# Altium schematic sheet 04_STM32F373VBTx.SchDoc
size 420 x 297 mm; SheetNumber: 4; SheetTotal: 12
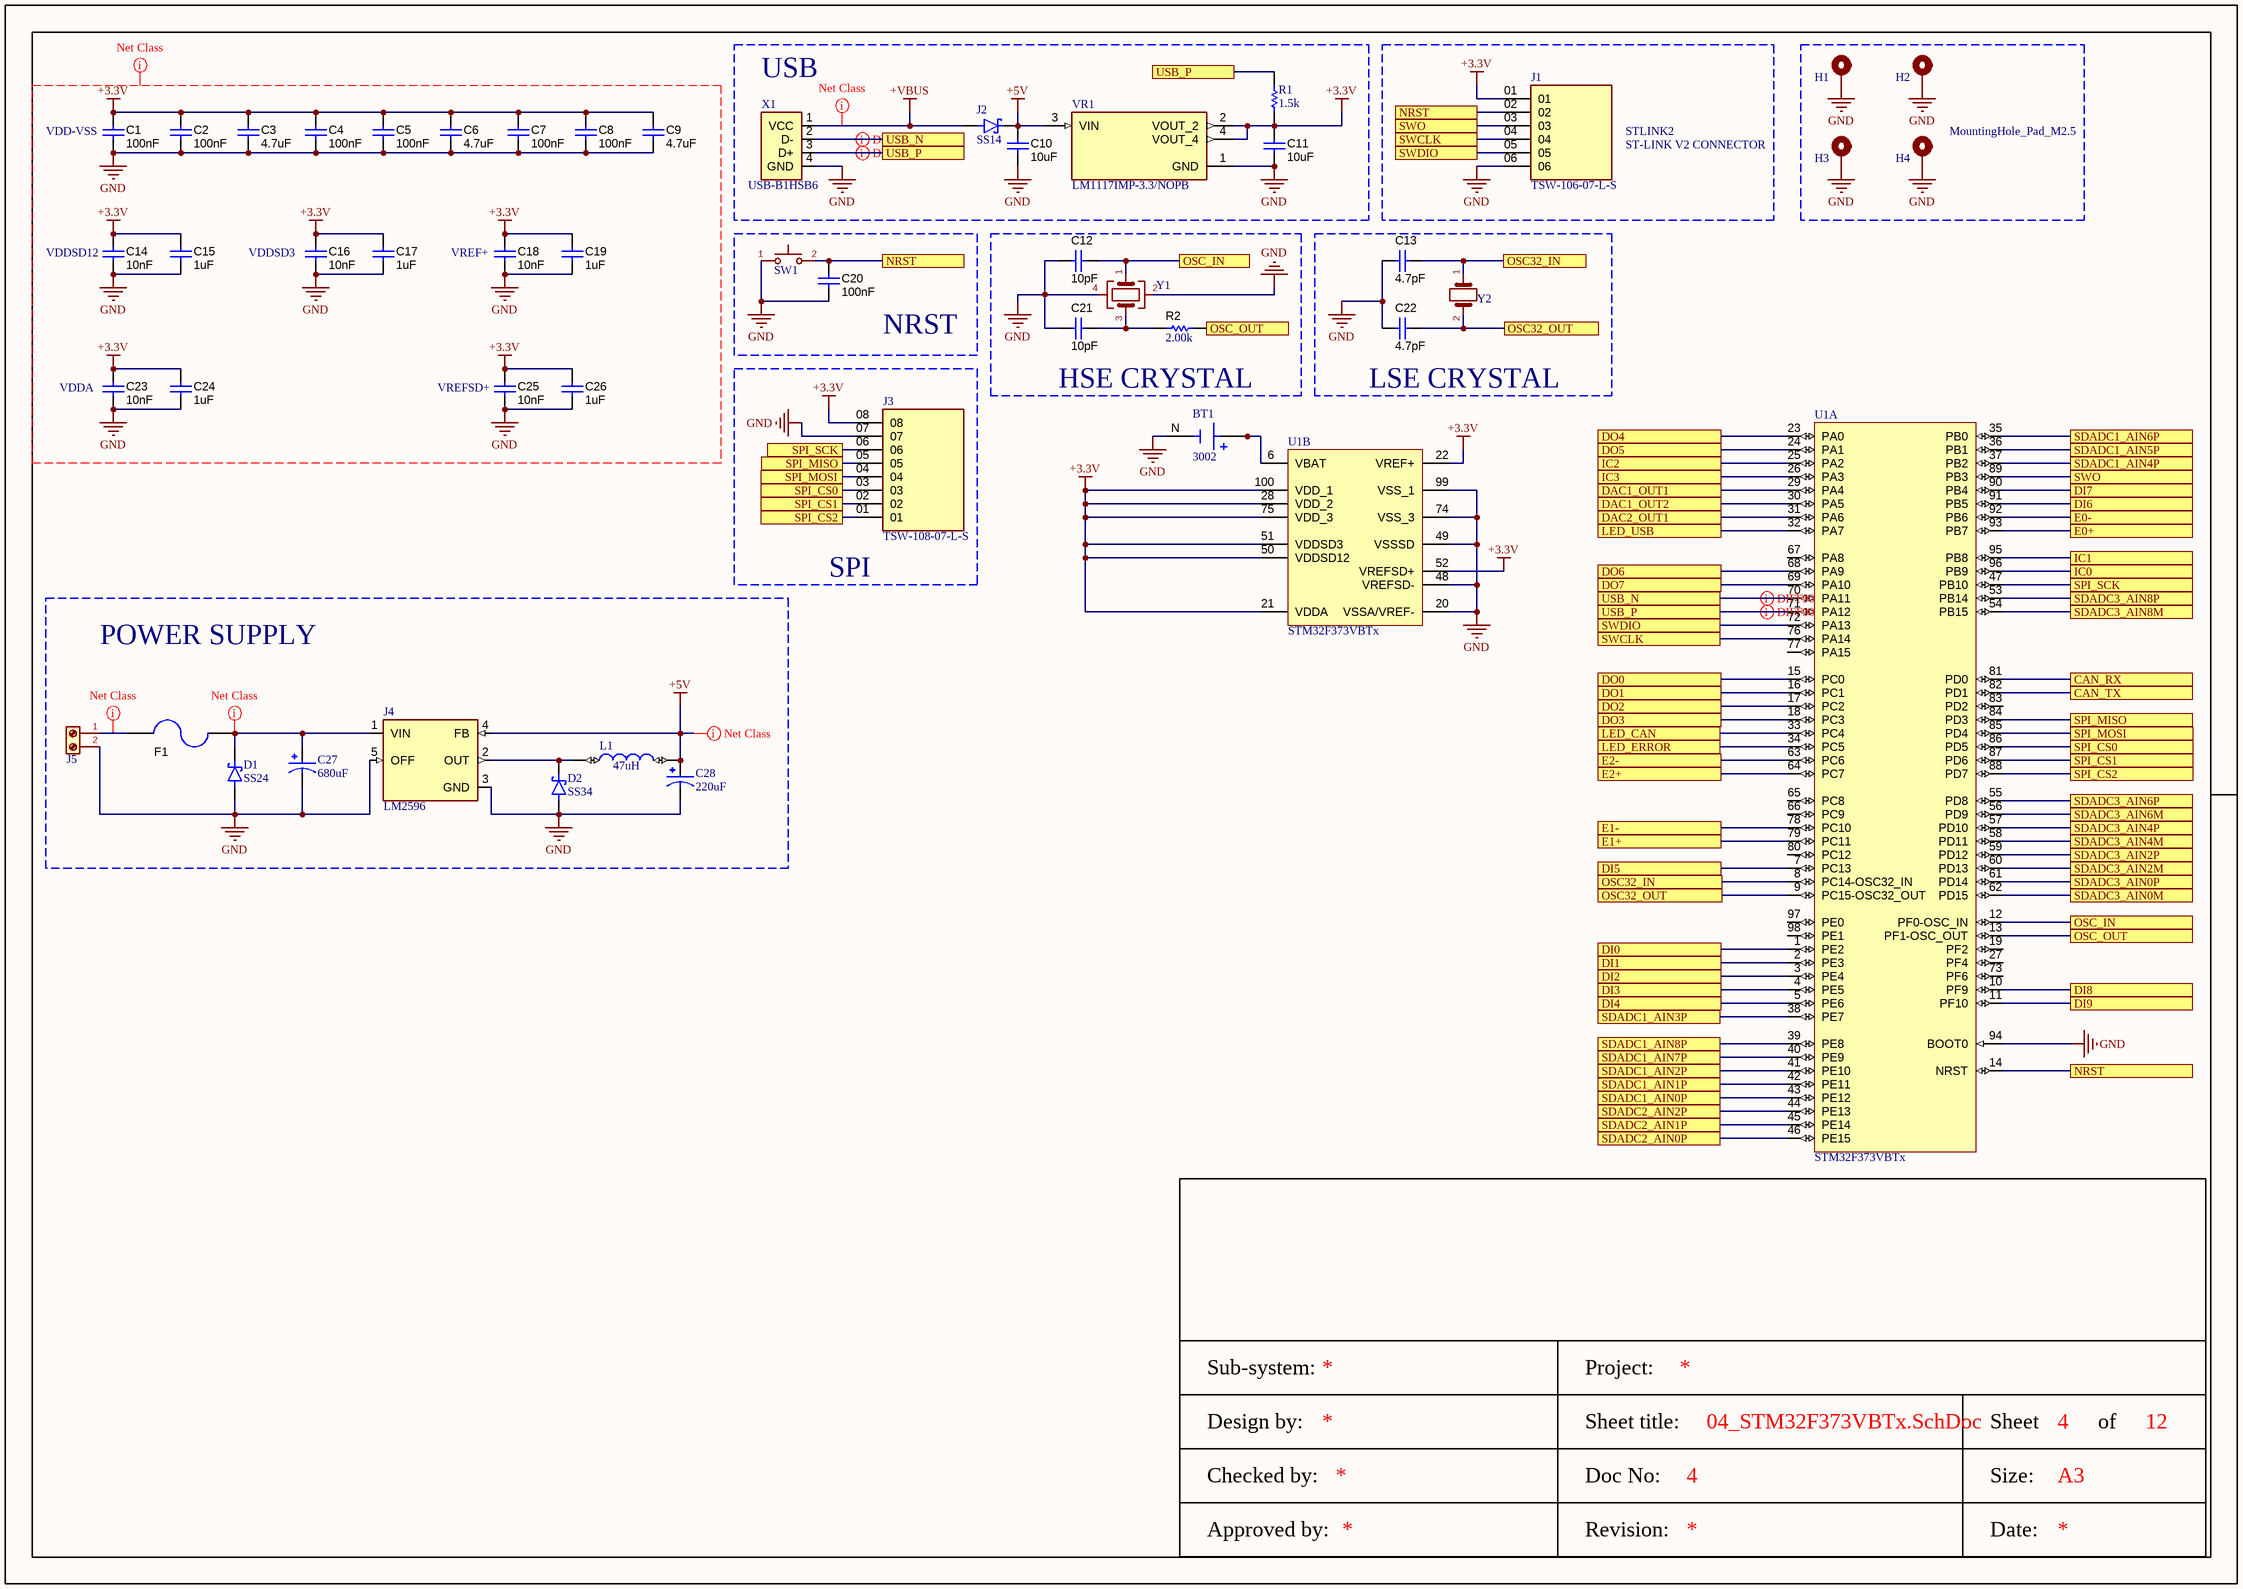
[diagram p0: 04_STM32F373VBTx.SchDoc]

## Parts
BT1  3002  [BAT_3002]
C1  ValueDisplayed: 100nF  [0603]  (hidden comment: CAP 100nF 0603)
C2  ValueDisplayed: 100nF  [0603]  (hidden comment: CAP 100nF 0603)
C3  ValueDisplayed: 4.7uF  [0603]  (hidden comment: CAP 4.7uF 0603)
C4  ValueDisplayed: 100nF  [0603]  (hidden comment: CAP 100nF 0603)
C5  ValueDisplayed: 100nF  [0603]  (hidden comment: CAP 100nF 0603)
C6  ValueDisplayed: 4.7uF  [0603]  (hidden comment: CAP 4.7uF 0603)
C7  ValueDisplayed: 100nF  [0603]  (hidden comment: CAP 100nF 0603)
C8  ValueDisplayed: 100nF  [0603]  (hidden comment: CAP 100nF 0603)
C9  ValueDisplayed: 4.7uF  [0603]  (hidden comment: CAP 4.7uF 0603)
C10  ValueDisplayed: 10uF  [0603]  (hidden comment: GCM188R71C105KA64D)
C11  ValueDisplayed: 10uF  [0603]  (hidden comment: GCM188R71C105KA64D)
C12  ValueDisplayed: 10pF  [0402L]  (hidden comment: CGA2B3X7R1H104K050BB)
C13  ValueDisplayed: 4.7pF  [0402L]  (hidden comment: GJM1555C1H4R7BB01D)
C14  ValueDisplayed: 10nF  [0603]  (hidden comment: CAP 10nF 0603)
C15  ValueDisplayed: 1uF  [0603]  (hidden comment: GCM188R71C105KA64D)
C16  ValueDisplayed: 10nF  [0603]  (hidden comment: CAP 10nF 0603)
C17  ValueDisplayed: 1uF  [0603]  (hidden comment: GCM188R71C105KA64D)
C18  ValueDisplayed: 10nF  [0603]  (hidden comment: CAP 10nF 0603)
C19  ValueDisplayed: 1uF  [0603]  (hidden comment: GCM188R71C105KA64D)
C20  ValueDisplayed: 100nF  [0603]  (hidden comment: CAP 100nF 0603)
C21  ValueDisplayed: 10pF  [0402L]  (hidden comment: CGA2B3X7R1H104K050BB)
C22  ValueDisplayed: 4.7pF  [0402L]  (hidden comment: GJM1555C1H4R7BB01D)
C23  ValueDisplayed: 10nF  [0603]  (hidden comment: CAP 10nF 0603)
C24  ValueDisplayed: 1uF  [0603]  (hidden comment: GCM188R71C105KA64D)
C25  ValueDisplayed: 10nF  [0603]  (hidden comment: CAP 10nF 0603)
C26  ValueDisplayed: 1uF  [0603]  (hidden comment: GCM188R71C105KA64D)
C27  680uF  [CAP_EEETK1V331AQ]
C28  220uF  [CAP_EEEFT1E471AV]
D1  SS24  [DIOM5336X265N]
D2  SS34  [DIOM5336X265N]
F1  0440005.WR  [CAPC4520X203N]  (value not drawn)
H1  MountingHole_Pad M2.5  [MountingHole_2.7mm_M2.5_DIN965_Pad]  (value not drawn)
H2  MountingHole_Pad M2.5  [MountingHole_2.7mm_M2.5_DIN965_Pad]  (value not drawn)
H3  MountingHole_Pad M2.5  [MountingHole_2.7mm_M2.5_DIN965_Pad]  (value not drawn)
H4  MountingHole_Pad M2.5  [MountingHole_2.7mm_M2.5_DIN965_Pad]  (value not drawn)
J1  TSW-106-07-L-S  [SAMTEC_TSW-106-07-L-S]
J2  SS14  [SMA]
J3  TSW-108-07-L-S  [SAMTEC_TSW-108-07-L-S]
J4  LM2596  [TO263-5]
J5  Terminal_01x02_P5.00  [TerminalBlock_Phoenix_PT-1,5-2-5.0-H_1x02_P5.00mm_Horizontal]  (value not drawn)
L1  47uH  [INDPM120120X800N]
R1  ValueDisplayed: 1.5k  [0603]  (hidden comment: RES 1.5K 0603)
R2  ValueDisplayed: 2.00k  [0402L]  (hidden comment: CRCW04021K00FKED)
SW1  SW_Push 3X6x2.5MM  [SW_SPST_FSMSM]  (value not drawn)
U1  STM32F373VBTx  [STM-LQFP100_N]  (parts A,B of 2)
VR1  LM1117IMP-3.3/NOPB  [VREG_LM1117IMP-3.3/NOPB]
X1  USB-B1HSB6  [OST_USB-B1HSB6]
Y1  Crystal 8MHz 3225  [Crystal_SMD_3225-4Pin_3.2x2.5mm_HandSoldering]  (value not drawn)
Y2  Crystal 32.768KHz 3215  [Crystal_SMD_EuroQuartz_EQ161-2Pin_3.2x1.5mm_HandSoldering]  (value not drawn)

## Blocks framed on the sheet
USB: C10 C11 J2 R1 VR1 X1
MountingHole_Pad_M2.5: H1-H4
NRST: C20 SW1
HSE CRYSTAL: C12 C21 R2 Y1
LSE CRYSTAL: C13 C22 Y2
SPI: J3
POWER SUPPLY: C27 C28 D1 D2 F1 J4 J5 L1

## Ports
CAN_RX (see 09_CAN[1A]), CAN_TX (see 09_CAN[1A]), DAC1_OUT1 (see 11_DAC[1A]), DAC1_OUT2 (see 11_DAC[1B]), DAC2_OUT1 (see 11_DAC[2A]), DI0 (see 05_INPUT[2A]), DI1 (see 05_INPUT[2B]), DI2 (see 05_INPUT[2B]), DI3 (see 05_INPUT[2C]), DI4 (see 05_INPUT[2C]), DI5 (see 05_INPUT[3A]), DI6 (see 05_INPUT[3B]), DI7 (see 05_INPUT[3B]), DI8 (see 05_INPUT[3C]), DI9 (see 05_INPUT[3C]), DO0 (see 06_DIGITAL[1A]), DO1 (see 06_DIGITAL[1B]), DO2 (see 06_DIGITAL[1B]), DO3 (see 06_DIGITAL[1C]), DO4 (see 06_DIGITAL[2A]), DO5 (see 06_DIGITAL[2B]), DO6 (see 06_DIGITAL[2B]), DO7 (see 06_DIGITAL[2C]), E0+ (see 08_INPUTCAPTURE_ENCODER[5B]), E0- (see 08_INPUTCAPTURE_ENCODER[5B]), E1+ (see 08_INPUTCAPTURE_ENCODER[5B]), E1- (see 08_INPUTCAPTURE_ENCODER[5B]), E2+ (see 08_INPUTCAPTURE_ENCODER[5B]), E2- (see 08_INPUTCAPTURE_ENCODER[5B]), IC0 (see 08_INPUTCAPTURE_ENCODER[3B]), IC1 (see 08_INPUTCAPTURE_ENCODER[3B]), IC2 (see 08_INPUTCAPTURE_ENCODER[3B]), IC3 (see 08_INPUTCAPTURE_ENCODER[3B]), LED_CAN (see 12_LED[2B]), LED_ERROR (see 12_LED[2B]), LED_USB (see 12_LED[2A]), NRST (see 04_STM32F373VBTx[3A], 04_STM32F373VBTx[4A]), NRST (see 04_STM32F373VBTx[3A], 04_STM32F373VBTx[6C]), NRST (see 04_STM32F373VBTx[4A], 04_STM32F373VBTx[6C]), OSC32_IN (see 04_STM32F373VBTx[5A]), OSC32_IN (see 04_STM32F373VBTx[5C]), OSC32_OUT (see 04_STM32F373VBTx[5A]), OSC32_OUT (see 04_STM32F373VBTx[5C]), OSC_IN (see 04_STM32F373VBTx[4A]), OSC_IN (see 04_STM32F373VBTx[6C]), OSC_OUT (see 04_STM32F373VBTx[4A]), OSC_OUT (see 04_STM32F373VBTx[6C]), SDADC1_AIN0P (see 10_SDADC[3B]), SDADC1_AIN1P (see 10_SDADC[3A]), SDADC1_AIN2P (see 10_SDADC[3A]), SDADC1_AIN3P (see 10_SDADC[2B]), SDADC1_AIN4P (see 10_SDADC[2B]), SDADC1_AIN5P (see 10_SDADC[2A]), SDADC1_AIN6P (see 10_SDADC[2A]), SDADC1_AIN7P (see 10_SDADC[2C]), SDADC1_AIN8P (see 10_SDADC[2B]), SDADC2_AIN0P (see 10_SDADC[3C]), SDADC2_AIN1P (see 10_SDADC[3B]), SDADC2_AIN2P (see 10_SDADC[3B]), SDADC3_AIN0M (see 07_SDDADC[3B]), SDADC3_AIN0P (see 07_SDDADC[3B]), SDADC3_AIN2M (see 07_SDDADC[3A]), SDADC3_AIN2P (see 07_SDDADC[3A]), SDADC3_AIN4M (see 07_SDDADC[2C]), SDADC3_AIN4P (see 07_SDDADC[2B]), SDADC3_AIN6M (see 07_SDDADC[2B]), SDADC3_AIN6P (see 07_SDDADC[2B]), SDADC3_AIN8M (see 07_SDDADC[2A]), SDADC3_AIN8P (see 07_SDDADC[2A]), SPI_CS0 (see 04_STM32F373VBTx[3B]), SPI_CS0 (see 04_STM32F373VBTx[6B]), SPI_CS1 (see 04_STM32F373VBTx[3B]), SPI_CS1 (see 04_STM32F373VBTx[6B]), SPI_CS2 (see 04_STM32F373VBTx[3B]), SPI_CS2 (see 04_STM32F373VBTx[6B]), SPI_MISO (see 04_STM32F373VBTx[3B]), SPI_MISO (see 04_STM32F373VBTx[6B]), SPI_MOSI (see 04_STM32F373VBTx[3B]), SPI_MOSI (see 04_STM32F373VBTx[6B]), SPI_SCK (see 04_STM32F373VBTx[3B]), SPI_SCK (see 04_STM32F373VBTx[6B]), SWCLK (see 04_STM32F373VBTx[4A]), SWCLK (see 04_STM32F373VBTx[5B]), SWDIO (see 04_STM32F373VBTx[4A]), SWDIO (see 04_STM32F373VBTx[5B]), SWO (see 04_STM32F373VBTx[4A]), SWO (see 04_STM32F373VBTx[6B]), USB_N (see 04_STM32F373VBTx[3A]), USB_N (see 04_STM32F373VBTx[5B]), USB_P (see 04_STM32F373VBTx[3A], 04_STM32F373VBTx[4A]), USB_P (see 04_STM32F373VBTx[3A], 04_STM32F373VBTx[5B]), USB_P (see 04_STM32F373VBTx[4A], 04_STM32F373VBTx[5B])

## Nets
+3.3V: C1.1 C2.1 C3.1 C4.1 C5.1 C6.1 C7.1 C8.1 C9.1 C11.1 C14.1 C15.1 C16.1 C17.1 C18.1 C19.1 C23.1 C24.1 C25.1 C26.1 J1.01 J3.08 R1.1 U1.21(VDDA) U1.22(VREF+) U1.28(VDD_2) U1.50(VDDSD12) U1.51(VDDSD3) U1.52(VREFSD+) U1.75(VDD_3) U1.100(VDD_1) VR1.2(VOUT_2) VR1.4(VOUT_4)
+5V: C10.1 C28.1 J2.P2(C) J4.4(FB) L1.2 VR1.3(VIN)
+VBUS: J2.P1(A) X1.1(VCC)
GND: BT1.N(NEG) C1.2 C2.2 C3.2 C4.2 C5.2 C6.2 C7.2 C8.2 C9.2 C10.2 C11.2 C12.2 C13.2 C14.2 C15.2 C16.2 C17.2 C18.2 C19.2 C20.2 C21.2 C22.2 C23.2 C24.2 C25.2 C26.2 C27.2 C28.2 D1.A D2.A H1.1 H2.1 H3.1 H4.1 J1.06 J3.07 J4.3(GND) J4.5(OFF) J5.2(Pin_2) SW1.1 U1.20(VSSA/VREF-) U1.48(VREFSD-) U1.49(VSSSD) U1.74(VSS_3) U1.94(BOOT0) U1.99(VSS_1) VR1.1(GND) X1.4(GND) Y1.2 Y1.4
CAN_RX: U1.81(PD0) ; port CAN_RX
CAN_TX: U1.82(PD1) ; port CAN_TX
DAC1_OUT1: U1.29(PA4) ; port DAC1_OUT1
DAC1_OUT2: U1.30(PA5) ; port DAC1_OUT2
DAC2_OUT1: U1.31(PA6) ; port DAC2_OUT1
DI0: U1.1(PE2) ; port DI0
DI1: U1.2(PE3) ; port DI1
DI2: U1.3(PE4) ; port DI2
DI3: U1.4(PE5) ; port DI3
DI4: U1.5(PE6) ; port DI4
DI5: U1.7(PC13) ; port DI5
DI6: U1.91(PB5) ; port DI6
DI7: U1.90(PB4) ; port DI7
DI8: U1.10(PF9) ; port DI8
DI9: U1.11(PF10) ; port DI9
DO0: U1.15(PC0) ; port DO0
DO1: U1.16(PC1) ; port DO1
DO2: U1.17(PC2) ; port DO2
DO3: U1.18(PC3) ; port DO3
DO4: U1.23(PA0) ; port DO4
DO5: U1.24(PA1) ; port DO5
DO6: U1.68(PA9) ; port DO6
DO7: U1.69(PA10) ; port DO7
E0+: U1.93(PB7) ; port E0+
E0-: U1.92(PB6) ; port E0-
E1+: U1.79(PC11) ; port E1+
E1-: U1.78(PC10) ; port E1-
E2+: U1.64(PC7) ; port E2+
E2-: U1.63(PC6) ; port E2-
IC0: U1.96(PB9) ; port IC0
IC1: U1.95(PB8) ; port IC1
IC2: U1.25(PA2) ; port IC2
IC3: U1.26(PA3) ; port IC3
LED_CAN: U1.33(PC4) ; port LED_CAN
LED_ERROR: U1.34(PC5) ; port LED_ERROR
LED_USB: U1.32(PA7) ; port LED_USB
NRST: C20.1 J1.02 SW1.2 U1.14(NRST) ; port NRST
OSC32_IN: C13.1 U1.8(PC14-OSC32_IN) Y2.1 ; port OSC32_IN
OSC32_OUT: C22.1 U1.9(PC15-OSC32_OUT) Y2.2 ; port OSC32_OUT
OSC_IN: C12.1 U1.12(PF0-OSC_IN) Y1.1 ; port OSC_IN
OSC_OUT: R2.2 U1.13(PF1-OSC_OUT) ; port OSC_OUT
SDADC1_AIN0P: U1.43(PE12) ; port SDADC1_AIN0P
SDADC1_AIN1P: U1.42(PE11) ; port SDADC1_AIN1P
SDADC1_AIN2P: U1.41(PE10) ; port SDADC1_AIN2P
SDADC1_AIN3P: U1.38(PE7) ; port SDADC1_AIN3P
SDADC1_AIN4P: U1.37(PB2) ; port SDADC1_AIN4P
SDADC1_AIN5P: U1.36(PB1) ; port SDADC1_AIN5P
SDADC1_AIN6P: U1.35(PB0) ; port SDADC1_AIN6P
SDADC1_AIN7P: U1.40(PE9) ; port SDADC1_AIN7P
SDADC1_AIN8P: U1.39(PE8) ; port SDADC1_AIN8P
SDADC2_AIN0P: U1.46(PE15) ; port SDADC2_AIN0P
SDADC2_AIN1P: U1.45(PE14) ; port SDADC2_AIN1P
SDADC2_AIN2P: U1.44(PE13) ; port SDADC2_AIN2P
SDADC3_AIN0M: U1.62(PD15) ; port SDADC3_AIN0M
SDADC3_AIN0P: U1.61(PD14) ; port SDADC3_AIN0P
SDADC3_AIN2M: U1.60(PD13) ; port SDADC3_AIN2M
SDADC3_AIN2P: U1.59(PD12) ; port SDADC3_AIN2P
SDADC3_AIN4M: U1.58(PD11) ; port SDADC3_AIN4M
SDADC3_AIN4P: U1.57(PD10) ; port SDADC3_AIN4P
SDADC3_AIN6M: U1.56(PD9) ; port SDADC3_AIN6M
SDADC3_AIN6P: U1.55(PD8) ; port SDADC3_AIN6P
SDADC3_AIN8M: U1.54(PB15) ; port SDADC3_AIN8M
SDADC3_AIN8P: U1.53(PB14) ; port SDADC3_AIN8P
SPI_CS0: J3.03 U1.86(PD5) ; port SPI_CS0
SPI_CS1: J3.02 U1.87(PD6) ; port SPI_CS1
SPI_CS2: J3.01 U1.88(PD7) ; port SPI_CS2
SPI_MISO: J3.05 U1.84(PD3) ; port SPI_MISO
SPI_MOSI: J3.04 U1.85(PD4) ; port SPI_MOSI
SPI_SCK: J3.06 U1.47(PB10) ; port SPI_SCK
SWCLK: J1.04 U1.76(PA14) ; port SWCLK
SWDIO: J1.05 U1.72(PA13) ; port SWDIO
SWO: J1.03 U1.89(PB3) ; port SWO
USB_N: U1.70(PA11) X1.2(D-) ; port USB_N
USB_P: R1.2 U1.71(PA12) X1.3(D+) ; port USB_P
NetBT1_P1: BT1.P1(POS) BT1.P2(POS) U1.6(VBAT)
NetC21_1: C21.1 R2.1 Y1.3
NetC27_1: C27.1 D1.C(K) F1.1 J4.1(VIN)
NetD2_C: D2.C(K) J4.2(OUT) L1.1
NetF1_2: F1.2 J5.1(Pin_1)

Not connected (* = marked no-connect by the designer): U1 19(PF2) 27(PF4) 65(PC8) 66(PC9) 67(PA8) 73(PF6) 77(PA15) 80(PC12) 83(PD2) 97(PE0) 98(PE1)

## Layout directives
net class PWR: +3.3V, +5V, +VBUS, GND, NetC27_1, NetF1_2
differential pair; differential pair class DIFF90: USB_N, USB_P

## Notes on the sheet
- (near C1) VDD-VSS
- STLINK2
- ST-LINK V2 CONNECTOR
- (near C14) VDDSD12
- (near C16) VDDSD3
- (near C18) VREF+
- (near C23) VDDA
- (near C25) VREFSD+
- Sub-system:
- Project:
- Design by:
- Sheet title:
- Sheet
- of
- Checked by:
- Approved by:
- Doc No:
- Revision:
- Size:
- Date:
- A3

## Library data of the parts
BT1 = 3002: Battery Holder: SMT, 1 Coin Cell, 20mm, PhosBronze/Tin-Nickel | Keystone Electronics 3002; MF: Keystone Electronics Corp.; SnapEDA_Link: https://www.snapeda.com/parts/3002/Keystone/view-part/?ref=snap; Package: NON STANDARD-2 Keystone; Value: *; MP: 3002; Check_prices: https://www.snapeda.com/parts/3002/Keystone/view-part/?ref=eda
C1 C2 C4 C5 C7 C8 C20 = CAP 100nF 0603: CAP, CERM, 100 nF, 25 V, +/- 10%, X7R, AEC-Q200 Grade 1, 0603; Manufacturer: MuRata; PartNumber: GCM188R70J225KE22D; TaMin_C: -55°C; Polarized: N; SizeAreaWB_mm2: 4.68; Value1: Unknown; U/M: EA; Value: 2.2uF; TaMax_C: 125°C; SizeZ_mm: 1; SizeX_mm: 1.6; SizeY_mm: 0.8; Value2: 6.3V; SizeArea_mm2: 1.28; CompType: Capacitor; AEC Qualified: Y; Cap_F: 2.2µF; AEC Category: Q200; Supplier Part Number 2: 81-GCM188R70J225KE2D; Publisher: Texas Instruments; Supplier 2: Mouser; TempCo: X7R; Published: 2008-06-19; RoHS: Y; MountType: SMT; Supplier 1: Digi-Key; PackageReference: 0603; Tolerance_%: 10%; Cap_Case: 0603; LatestRevisionDate: 2017-03-09; VDC_V: 6.3V; ComponentLink1Description: Datasheet link; AEC Grade: 1; Supplier Part Number 1: 490-5316-1-ND; Technology: Ceramic; ComponentLink1URL: http://psearch.en.murata.com/capacitor/product/GCM188R70J225KE22%23.pdf
C3 C6 C9 = CAP 4.7uF 0603: CAP, CERM, 4.7 uF, 10 V, +/- 10%, X7R, AEC-Q200 Grade 1, 0603; Manufacturer: MuRata; PartNumber: GCM188R70J225KE22D; TaMin_C: -55°C; Polarized: N; SizeAreaWB_mm2: 4.68; Value1: Unknown; U/M: EA; Value: 2.2uF; TaMax_C: 125°C; SizeZ_mm: 1; SizeX_mm: 1.6; SizeY_mm: 0.8; Value2: 6.3V; SizeArea_mm2: 1.28; CompType: Capacitor; AEC Qualified: Y; Cap_F: 2.2µF; AEC Category: Q200; Supplier Part Number 2: 81-GCM188R70J225KE2D; Publisher: Texas Instruments; Supplier 2: Mouser; TempCo: X7R; Published: 2008-06-19; RoHS: Y; MountType: SMT; Supplier 1: Digi-Key; PackageReference: 0603; Tolerance_%: 10%; Cap_Case: 0603; LatestRevisionDate: 2017-03-09; VDC_V: 6.3V; ComponentLink1Description: Datasheet link; AEC Grade: 1; Supplier Part Number 1: 490-5316-1-ND; Technology: Ceramic; ComponentLink1URL: http://psearch.en.murata.com/capacitor/product/GCM188R70J225KE22%23.pdf
C10 C11 C15 C17 C19 C24 C26 = CAP 1uF 0603: CAP, CERM, 1 uF, 16 V, +/- 10%, X7R, AEC-Q200 Grade 1, 0603; Manufacturer: MuRata; TaMin_C: -55°C; Polarized: N; SizeAreaWB_mm2: 4.68; Value1: Unknown; U/M: EA; Value: 1uF; TaMax_C: 125°C; SizeZ_mm: 1; SizeX_mm: 1.6; SizeY_mm: 0.8; Value2: 16V; SizeArea_mm2: 1.28; CompType: Capacitor; AEC Qualified: Y; Cap_F: 1µF; AEC Category: Q200; Supplier Part Number 2: 81-GCM188R71C105K64D; Publisher: Texas Instruments; Supplier 2: Mouser; TempCo: X7R; Published: 2008-06-19; RoHS: Y; MountType: SMT; Supplier 1: Digi-Key; PackageReference: 0603; Tolerance_%: 10%; Cap_Case: 0603; LatestRevisionDate: 2017-03-09; PartNumber: GCM188R71C105KA64D; VDC_V: 16V; ComponentLink1Description: Datasheet link; AEC Grade: 1; Supplier Part Number 1: 490-5241-6-ND; Technology: Ceramic; ComponentLink1URL: http://psearch.en.murata.com/capacitor/product/GCM188R71C105KA64%23.pdf
C12 C21 = CAP 10pF 0402 50V: CAP, CERM, 10 pF, 50 V, +/- 5%, X7R, AEC-Q200 Grade 1, 0402; Manufacturer: TDK; TaMin_C: -55°C; ESR_ohm: 0.039064; Polarized: N; SizeAreaWB_mm2: 3; Value1: 0.039064 ohm; U/M: EA; Value: 0.1uF; TaMax_C: 125°C; Tolerance_%: 10%; SizeZ_mm: 0.6; SizeX_mm: 1; SizeY_mm: 0.5; Cap_Case: 0402; Value2: 50V; CompType: Capacitor; AEC Qualified: Y; Cap_F: 100nF; IRMS_A: 8.14669dA; AEC Category: Q200; Supplier Part Number 2: 04X3148; Publisher: Texas Instruments; Supplier 2: Newark; Supplier Part Number 3: 810-CGA2B3X7R1H104K; TempCo: X7R; Supplier 3: Mouser; Published: 2008-06-19; RoHS: Y; MountType: SMT; Supplier 1: Digi-Key; PackageReference: 0402; SizeArea_mm2: 0.5; LatestRevisionDate: 2017-03-09; PartNumber: CGA2B3X7R1H104K050BB; VDC_V: 50V; ComponentLink1Description: Datasheet link; AEC Grade: 1; Supplier Part Number 1: 445-6899-1-ND; Technology: Ceramic; ComponentLink1URL: https://product.tdk.com/en/search/capacitor/ceramic/mlcc/info?part_no=CGA2B3X7R1H104K050BB
C13 C22 = CAP 4.7pF 0402: CAP, CERM, 4.7 pF, 50 V, +/- 2%, C0G/NP0, 0402; Manufacturer: MuRata; TaMin_C: -55°C; Polarized: N; SizeAreaWB_mm2: 3; Value1: Unknown; U/M: EA; Value: 4.7pF; TaMax_C: 125°C; SizeZ_mm: 0.6; SizeX_mm: 1; SizeY_mm: 0.5; Cap_Case: 0402; Value2: 50V; CompType: Capacitor; AEC Category: Q200; Supplier Part Number 2: 81-GJM1555C1H4R7BB01; Publisher: Texas Instruments; Supplier 2: Mouser; TempCo: C0G/NP0; Published: 2008-06-19; RoHS: Y; MountType: SMT; Supplier 1: Digi-Key; PackageReference: 0402; Tolerance_%: 2%; SizeArea_mm2: 0.5; LatestRevisionDate: 2017-03-09; PartNumber: GJM1555C1H4R7BB01D; AEC Qualified: N; Cap_F: 4.7pF; VDC_V: 50V; ComponentLink1Description: Datasheet link; AEC Grade: N/A; Supplier Part Number 1: 490-8102-1-ND; Technology: Ceramic; ComponentLink1URL: http://psearch.murata.com/capacitor/product/GJM1555C1H4R7BB01%23.pdf
C14 C16 C18 C23 C25 = CAP 10nF 0603: CAP, CERM, 10 nF, 50 V, +/- 10%, X7R, AEC-Q200 Grade 1, 0603; Manufacturer: MuRata; PartNumber: GCM188R70J225KE22D; TaMin_C: -55°C; Polarized: N; SizeAreaWB_mm2: 4.68; Value1: Unknown; U/M: EA; Value: 2.2uF; TaMax_C: 125°C; SizeZ_mm: 1; SizeX_mm: 1.6; SizeY_mm: 0.8; Value2: 6.3V; SizeArea_mm2: 1.28; CompType: Capacitor; AEC Qualified: Y; Cap_F: 2.2µF; AEC Category: Q200; Supplier Part Number 2: 81-GCM188R70J225KE2D; Publisher: Texas Instruments; Supplier 2: Mouser; TempCo: X7R; Published: 2008-06-19; RoHS: Y; MountType: SMT; Supplier 1: Digi-Key; PackageReference: 0603; Tolerance_%: 10%; Cap_Case: 0603; LatestRevisionDate: 2017-03-09; VDC_V: 6.3V; ComponentLink1Description: Datasheet link; AEC Grade: 1; Supplier Part Number 1: 490-5316-1-ND; Technology: Ceramic; ComponentLink1URL: http://psearch.en.murata.com/capacitor/product/GCM188R70J225KE22%23.pdf
C27 = CAP ALUMINUM: CAPACITOR ALUM ELEC, 330UF, 20%, 35V, SMD; Product Range:PANASONIC - TK Series; Capacitance:330ÂµF; Capacitance Tolerance:Â± 20%; Capacitor Case Style:SMD; Diameter:12.5mm; ESR:0.12ohm; Height:13.5mm; Operating Temperature Max:125Â°C ;RoHS Compliant: Yes; MP: EEETK1V331AQ; Value: *; Price: None; Package: RADIAL-2 Panasonic; MF: Panasonic; Availability: No availability data; Check_prices: https://www.snapeda.com/parts/EEETK1V331AQ/Panasonic/view-part/5787067/?ref=eda; SnapEDA_Link: https://www.snapeda.com/parts/EEETK1V331AQ/Panasonic/view-part/5787067/?ref=snap
C28 = CAP ALUMINUM 8X10.5MM: Aluminum Electrolytic Capacitors, FT-V (????????) Series, 470uF +/- 20%, 25V, Surface mount type(8x10.5mm) Vibration-proof product; MF: Panasonic; MP: EEE-FT1E471AV; SnapEDA_Link: https://www.snapeda.com/parts/EEE-FT1E471AV/Panasonic/view-part/?ref=snap; Package: RADIAL-2 Panasonic; Value: *; Check_prices: https://www.snapeda.com/parts/EEE-FT1E471AV/Panasonic/view-part/?ref=eda
D1 D2 = SS24: Diode Schottky 40V 2A Surface Mount DO-214AA (SMB); MF: ON Semiconductor; Package: DO-214AA ON Semiconductor; Price: None; Value: *; SnapEDA_Link: https://www.snapeda.com/parts/SS24/Onsemi/view-part/?ref=snap; MP: SS24; Availability: In Stock; Check_prices: https://www.snapeda.com/parts/SS24/Onsemi/view-part/?ref=eda
F1 = FUSE 1808: Fuse, 5 A, 32VAC/VDC, SMD; Manufacturer: Littelfuse; Irating_A: 5A; SizeAreaWB_mm2: 10.92; Interrupt_AC: 50A; VAC_V: 32V; SizeZ_mm: 1.35; SizeX_mm: 3.2; SizeY_mm: 1.6; SizeArea_mm2: 5.12; Rtyp_Ohm: 0.012; MeltingTyp: 4.761; ComponentLink1URL: http://www.littelfuse.com/~/media/electronics/datasheets/fuses/littelfuse_fuse_440_datasheet.pdf.pdf; Supplier Part Number 2: 64R8013; Supplier 2: Newark; Supplier Part Number 3: 576-0440005.WR; Supplier 3: Mouser; RoHS: Y; MountType: SMT; Interrupt_DC: 50A; Supplier 1: Digi-Key; PackageReference: 1206; CompType: Fuse; PartNumber: 0440005.WR; VDC_V: 32V; ComponentLink1Description: Datasheet URL; Supplier Part Number 1: F1608CT-ND
J1 = TSW-106-07-L-S: MF: Samtec Inc.; Package: None; MP: TSW-106-07-L-S; Price: None; Value: *; Availability: Unavailable
J2 = SS14: Diode Schottky 40 V 1A Surface Mount DO-214AC (SMA); MF: ON; SnapEDA_Link: https://www.snapeda.com/parts/SS14/Onsemi/view-part/?ref=snap; Package: SMA-2 ON Semiconductor; Value: *; MP: SS14; Check_prices: https://www.snapeda.com/parts/SS14/Onsemi/view-part/?ref=eda
J3 = TSW-108-07-L-S: MF: Samtec Inc.; Availability: Unavailable; Price: None; Package: None; Value: *; MP: TSW-108-07-L-S
J4 = LM2596: MF: Texas Instruments; SnapEDA_Link: https://www.snapeda.com/parts/LM2596/Texas+Instruments/view-part/?ref=snap; Package: Package; Value: *; MP: LM2596; Check_prices: https://www.snapeda.com/parts/LM2596/Texas+Instruments/view-part/?ref=eda
L1 = CDRH127_LDNP-221MC: 220 ÂµH Shielded - Inductor 1.45 A 338mOhm Max Nonstandard; MF: Sumida America; MP: CDRH127/LDNP-221MC; SnapEDA_Link: https://www.snapeda.com/parts/CDRH127/LDNP-221MC/Sumida+America+Components+Inc./view-part/?ref=snap; Package: Nonstandard Sumida; Value: *; Check_prices: https://www.snapeda.com/parts/CDRH127/LDNP-221MC/Sumida+America+Components+Inc./view-part/?ref=eda
R1 = RES 1.5K 0603 1%: RES, 1.5K, 1%, 0.1 W, AEC-Q200 Grade 0, 0603; Manufacturer: Vishay-Dale; PartNumber: CRCW060320R0JNEA; Power_W: 100mW; TempCo: 200 ppm/C; Value_Code: 20R0; Value1: 5%; Value: 20; EIA_Code: E24; SizeX_mm: 1.6; SizeY_mm: 0.8; SizeZ_mm: 1; Value2: 0.1W; SizeArea_mm2: 1.28; CompType: Resistor; AEC Qualified: Y; VDC_V: 75V; AEC Category: Q200; AEC Grade: 0; Supplier Part Number 2: 59M6784; Supplier 2: Newark; Supplier Part Number 3: 71-CRCW0603J-20-E3; Supplier 3: Mouser; RoHS: E; MountType: SMT; Supplier 1: Digi-Key; PackageReference: 0603; Tolerance_%: 5%; Res_ohm: 20; ComponentLink1Description: Datasheet link; Supplier Part Number 1: 541-20GCT-ND; Technology: Thick Film; ComponentLink1URL: http://www.vishay.com/docs/20035/dcrcwe3.pdf
R2 = RES 2K 0402: RES, 2.00 k, 5%, 0.063 W, AEC-Q200 Grade 0, 0402; Manufacturer: Vishay-Dale; Power_W: 63mW; TempCo: 100 ppm/C; Value_Code: 1k00; Value1: 1%; Value: 1.00k; EIA_Code: E96; Res_ohm: 1k; SizeX_mm: 1; SizeY_mm: 0.5; SizeZ_mm: 0.6; Value2: 0.063W; CompType: Resistor; AEC Qualified: Y; VDC_V: 50V; AEC Category: Q200; AEC Grade: 0; Supplier Part Number 2: 52K6545; Supplier 2: Newark; Supplier Part Number 3: 71-CRCW0402-1.0K-E3; Supplier 3: Mouser; RoHS: E; MountType: SMT; Supplier 1: Digi-Key; PackageReference: 0402; Tolerance_%: 1%; SizeArea_mm2: 0.5; PartNumber: CRCW04021K00FKED; ComponentLink1Description: Datasheet link; Supplier Part Number 1: 541-1.00KLCT-ND; Technology: Thick Film; ComponentLink1URL: http://www.vishay.com/docs/20035/dcrcwe3.pdf
U1 = STM32F373VBT7: ARM Cortex-M4 32-bit MCU, 128 KB Flash, 24 KB Internal RAM, 84 I/Os, 100-pin LQFP, -40 to 105 degC, Tray; Supply Voltage(Vcc) min (V): 2; Operating Frequency(F) (Processor speed) (MHz): 72; I/Os (High Current): 84; Internal RAM Size (kB): 24; FLASH Size (Prog) (kB): 128; DatasheetVersion: Rev. 3; Mounting Technology: Surface Mount; ComponentLink1Description: Manufacturer URL; Core: ARM Cortex-M4; ComponentLink2Description: Datasheet; PackageReference: LQFP100; PackageVersion: Rev. 1, 06/2013; ComponentLink3URL: http://www.st.com/st-web-ui/static/active/en/resource/technical/document/data_brief/DM00071938.pdf; PackageDescription: 100-Pin Low Profile Quad Flat Package, 14 x 14 mm Body, 0.5 mm Pitch; ComponentLink1URL: http://www.st.com/web/en/home.html; Packing: Tray; ComponentLink3Description: Package Specification; ComponentLink2URL: http://www.st.com/st-web-ui/static/active/en/resource/technical/document/datasheet/DM00046749.pdf; PartNumber: STM32F373VBT7
VR1 = LM1117IMP-3.3/NOPB: 800-mA 15-V linear voltage regulator; MF: Texas Instruments; SnapEDA_Link: https://www.snapeda.com/parts/LM1117IMP-3.3/NOPB/Texas+Instruments/view-part/?ref=snap; Package: SOT-223-4 Texas Instruments; Value: *; MP: LM1117IMP-3.3/NOPB; Check_prices: https://www.snapeda.com/parts/LM1117IMP-3.3/NOPB/Texas+Instruments/view-part/?ref=eda
X1 = USB-B1HSB6: USB-B (USB TYPE-B) - Receptacle Connector 4 Position Through Hole, Right Angle; MF: On Shore; Check_prices: https://www.snapeda.com/parts/USB-B1HSB6/On+Shore+Technology+Inc./view-part/?ref=eda; Value: *; Purchase-URL: https://pricing.snapeda.com/search/part/USB-B1HSB6/?ref=eda; Price: None; MP: USB-B1HSB6; SnapEDA_Link: https://www.snapeda.com/parts/USB-B1HSB6/On+Shore+Technology+Inc./view-part/?ref=snap; Availability: In Stock; Package: None